# Altium schematic sheet RHX-NYFK-SCH22V1.01.SchDoc
size A3; Date: 20190319; CompanyName: 瑞臻信息（深圳）有限公司; DrawnBy: Bob.Xu; Address1: 深圳市南山区深南路万利达大厦2201室; Address2: 昆山市花桥镇花桥国际商务城绿地大道231弄9号楼杰座大厦2111室; Address3: 成都市高新区天府二街138号蜀都中心3号楼3110室; Address4: 浙江省宁波市余姚市冶山路475号1401室; Revision: V1.01; SheetOf: 2/2; ProductTitle: 昊芯农业项目-阀控器; ModuleTitle: RS485&MOTOR; : CheckedBy; PageSetup: Record=PageOptions|CenterHorizontal=True|CenterVertical=True|PrintScale=0.73|XCorrection=1.00|YCorrection=1.00|PrintKind=0|BorderSize=5000000|LeftOffset=0|BottomOffset=0|Orientation=2|PaperLength=1000|PaperWidth=1000|Scale=100|PaperSource=7|PrintQuality=-3|MediaType=1|DitherType=10|PrintScaleMode=1|PaperKind=A4|PaperIndex=9
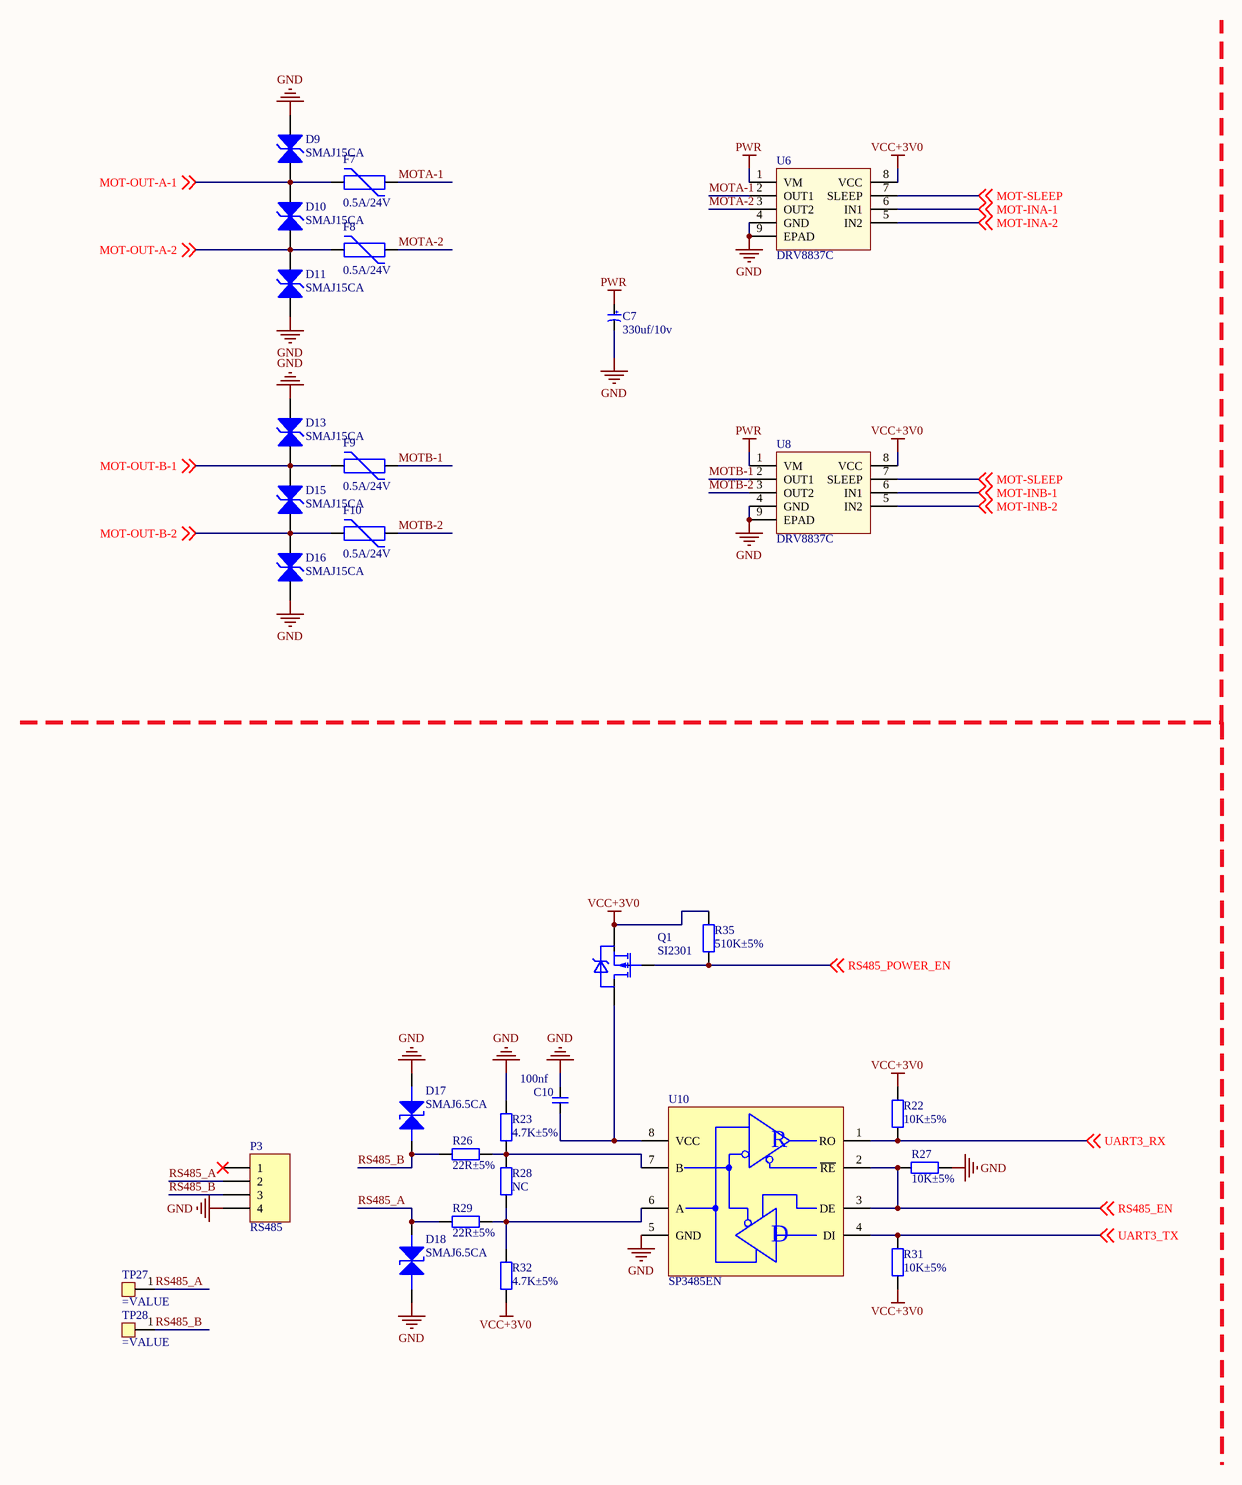
[diagram p0: RHX-NYFK-SCH22V1.01.SchDoc]

## Parts
C7  330uf/10v  [CAP_2P_2R5_D6R3H11_W]
C10  100nf  [c0402]
D9  SMAJ15CA  [SMA_2P_2R8X4R6]
D10  SMAJ15CA  [SMA_2P_2R8X4R6]
D11  SMAJ15CA  [SMA_2P_2R8X4R6]
D13  SMAJ15CA  [SMA_2P_2R8X4R6]
D15  SMAJ15CA  [SMA_2P_2R8X4R6]
D16  SMAJ15CA  [SMA_2P_2R8X4R6]
D17  SMAJ6.5CA  [SMA_2P_2R8X4R6]
D18  SMAJ6.5CA  [SMA_2P_2R8X4R6]
F7  0.5A/24V  [FUSE1210]
F8  0.5A/24V  [FUSE1210]
F9  0.5A/24V  [FUSE1210]
F10  0.5A/24V  [FUSE1210]
P3  RS485  [HDR1X4]
Q1  SI2301  [SOT23_3P_0R95_1R3X2R9]
R22  10K±5%  [R0402]
R23  4.7K±5%  [R0402]
R26  22R±5%  [R0402]
R27  10K±5%  [R0402]
R28  NC  [R0402]
R29  22R±5%  [R0402]
R31  10K±5%  [R0402]
R32  4.7K±5%  [R0402]
R35  510K±5%  [R0402]
TP27  (no value)  [TP_D1R25]
TP28  (no value)  [TP_D1R25]
U6  DRV8837C  [TDFN_8P_0R5_2R0X2R0_P]
U8  DRV8837C  [TDFN_8P_0R5_2R0X2R0_P]
U10  SP3485EN  [SOP_8P_1R27_3R9X4R9]

## Nets
GND: C7.2 C10.2 D9.2(K) D11.1(A) D13.2(K) D16.1(A) D17.2(K) D18.2(K) P3.4 R23.2 R27.2 U6.4(GND) U6.9(EPAD) U8.4(GND) U8.9(EPAD) U10.5(GND)
PWR: C7.1 U6.1(VM) U8.1(VM)
VCC+3V0: Q1.2(S) R22.2 R31.1 R32.1 R35.1 U6.8(VCC) U8.8(VCC)
MOT-INA-1: U6.6(IN1) ; off-sheet MOT-INA-1
MOT-INA-2: U6.5(IN2) ; off-sheet MOT-INA-2
MOT-INB-1: U8.6(IN1) ; off-sheet MOT-INB-1
MOT-INB-2: U8.5(IN2) ; off-sheet MOT-INB-2
MOT-OUT-A-1: D9.1(A) D10.2(K) F7.1 ; off-sheet MOT-OUT-A-1
MOT-OUT-A-2: D10.1(A) D11.2(K) F8.1 ; off-sheet MOT-OUT-A-2
MOT-OUT-B-1: D13.1(A) D15.2(K) F9.1 ; off-sheet MOT-OUT-B-1
MOT-OUT-B-2: D15.1(A) D16.2(K) F10.1 ; off-sheet MOT-OUT-B-2
MOT-SLEEP: U6.7(SLEEP) U8.7(SLEEP) ; off-sheet MOT-SLEEP
MOTA-1: F7.2 U6.2(OUT1)
MOTA-2: F8.2 U6.3(OUT2)
MOTB-1: F9.2 U8.2(OUT1)
MOTB-2: F10.2 U8.3(OUT2)
RS485_A: D18.1(A) P3.2 R29.2 TP27.1
RS485_B: D17.1(A) P3.3 R26.2 TP28.1
RS485_EN: R27.1 U10.2(~{RE}) U10.3(DE) ; off-sheet RS485_EN
RS485_POWER_EN: Q1.1(G) R35.2 ; off-sheet RS485_POWER_EN
UART3_RX: R22.1 U10.1(RO) ; off-sheet UART3_RX
UART3_TX: R31.2 U10.4(DI) ; off-sheet UART3_TX
NetC10_1: C10.1 Q1.3(D) U10.8(VCC)
NetR23_1: R23.1 R26.1 R28.2 U10.7(B)
NetR28_1: R28.1 R29.1 R32.2 U10.6(A)

Not connected (* = marked no-connect by the designer): P3 1*

## Notes on the sheet
- Product Title:
- Logo:
- Product Number:
- Mod Title:
- Size:
- Mod Number:
- A3
- SheetOf:
- Revision:
- DrawnBy:
- Date:
- CheckedBy:
- (in symbol 1.2.18.09.0173) R; D

## Library data of the parts
C7 = 极性电容
C10 = 无极性电容
D9-D11 D13 D15 D16 = 双向TVS管
D17 D18 = 1.2.08.07.0014: TVS管-SMBJ6.5CA-53.6A-单路-6.5Vrwm-8.3Vbr-600W-SMB
F7-F10 = PPTC
P3 = Header 4: Header, 4-Pin; LatestRevisionDate: 17-Jul-2002; LatestRevisionNote: Re-released for DXP Platform.; Publisher: Altium Limited
Q1 = P-MOS
R22 R27 R31 = 1.2.03.01.0012: 电阻-10K±5%-1/16W-0402; Supplier Manufacturer: 厂家; Old P/N: 00527; D/S: S; Edit Note: V1.0-创建-20161225-徐永伟; Grade: A; Part Number: 1.2.03.01.0012; Part Type: 贴片电阻; Value: 10K±5%; ComponentLink1URL: z:\altiumdesigner\规格书\02原材料\03电阻\01普通电阻\; Supplier: 供应商; Unit Price: ￥0.001; Footprint: 0402; ComponentLink1Description: 规格书; Component Type: standy; ComponentLink2Description: ROHS报告; ComponentLink2URL: z:\altiumdesigner\规格书\02原材料\03电阻\01普通电阻\; Pin Count: 2; Published: V1.0; Publisher: 徐永伟; ComponentLink3Description: 可靠性测试报告; ComponentLink3URL: z:\altiumdesigner\规格书\02原材料\03电阻\01普通电阻\; ComponentLink4URL: z:\altiumdesigner\规格书\02原材料\03电阻\01普通电阻\; ComponentLink4Description: 性能检测报告
R23 R32 = 1.2.03.01.0366: 电阻-4.7K±5%-1/16W-0402; Supplier Manufacturer: 厂家; Old P/N: 00810; D/S: S; Edit Note: V1.0-创建-20161225-徐永伟; Grade: A; Part Number: 1.2.03.01.0366; Part Type: 贴片电阻; Value: 4.7K±5%; ComponentLink1URL: z:\altiumdesigner\规格书\02原材料\03电阻\01普通电阻\; Supplier: 供应商; Unit Price: ￥0.001; Footprint: 0402; ComponentLink1Description: 规格书; Component Type: standy; ComponentLink2Description: ROHS报告; ComponentLink2URL: z:\altiumdesigner\规格书\02原材料\03电阻\01普通电阻\; Pin Count: 2; Published: V1.0; Publisher: 徐永伟; ComponentLink3Description: 可靠性测试报告; ComponentLink3URL: z:\altiumdesigner\规格书\02原材料\03电阻\01普通电阻\; ComponentLink4URL: z:\altiumdesigner\规格书\02原材料\03电阻\01普通电阻\; ComponentLink4Description: 性能检测报告
R26 R29 = 1.2.03.01.0573: 电阻-4.7R±5%-1/16W-0402; Supplier Manufacturer: 厂家; Old P/N: 01747; Value: 4.7R±5%; D/S: S; Edit Note: V1.0-创建-20161225-徐永伟; Grade: A; Part Number: 1.2.03.01.0573; Part Type: 贴片电阻; ComponentLink1URL: z:\altiumdesigner\规格书\02原材料\03电阻\01普通电阻\; Supplier: 供应商; Unit Price: ￥0.001; Footprint: 0402; ComponentLink1Description: 规格书; Component Type: standy; ComponentLink2Description: ROHS报告; ComponentLink2URL: z:\altiumdesigner\规格书\02原材料\03电阻\01普通电阻\; Pin Count: 2; Published: V1.0; Publisher: 徐永伟; ComponentLink3Description: 可靠性测试报告; ComponentLink3URL: z:\altiumdesigner\规格书\02原材料\03电阻\01普通电阻\; ComponentLink4URL: z:\altiumdesigner\规格书\02原材料\03电阻\01普通电阻\; ComponentLink4Description: 性能检测报告
R28 R35 = 1.2.03.01.0012: 电阻-10K±5%-1/16W-0402; Supplier Manufacturer: 厂家; Old P/N: 00527; Value: 10K±5%; D/S: S; Edit Note: V1.0-创建-20161225-徐永伟; Grade: A; Part Number: 1.2.03.01.0012; Part Type: 贴片电阻; ComponentLink1URL: z:\altiumdesigner\规格书\02原材料\03电阻\01普通电阻\; Supplier: 供应商; Unit Price: ￥0.001; Footprint: 0402; ComponentLink1Description: 规格书; Component Type: standy; ComponentLink2Description: ROHS报告; ComponentLink2URL: z:\altiumdesigner\规格书\02原材料\03电阻\01普通电阻\; Pin Count: 2; Published: V1.0; Publisher: 徐永伟; ComponentLink3Description: 可靠性测试报告; ComponentLink3URL: z:\altiumdesigner\规格书\02原材料\03电阻\01普通电阻\; ComponentLink4URL: z:\altiumdesigner\规格书\02原材料\03电阻\01普通电阻\; ComponentLink4Description: 性能检测报告
TP27 TP28 = Test_Point: 测试点
U10 = 1.2.18.09.0173: RS485收发器-SP3485EN-支持485收发-SOP8; Supplier Manufacturer: Sipex; Old P/N: 00289; D/S: S; Edit Note: V1.0-创建-20170122-徐永伟; Grade: A; Part Number: 1.2.18.09.0173; ComponentLink1URL: Z:\AltiumDesigner\规格书\02原材料\18集成电路\09接口芯片\SP3485EN.pdf; ComponentLink1Description: 规格书; ComponentLink2Description: ROHS报告; Part Type: 接口IC; Value: SP3485EN; height: 1.7mm; Model: SP3485EN; Unit Price: ￥0.001; Footprint: SOP8; Component Type: standy; Pin Count: 8; Published: V1.0; Publisher: 徐永伟